# Altium schematic sheet relay_driver.SchDoc
size A4; SheetNumber: 1; SheetTotal: 4; SPICEModelCacheXGPMMDWP: <root> / <DocumentId>XGPMMDWP</DocumentId> / </root>
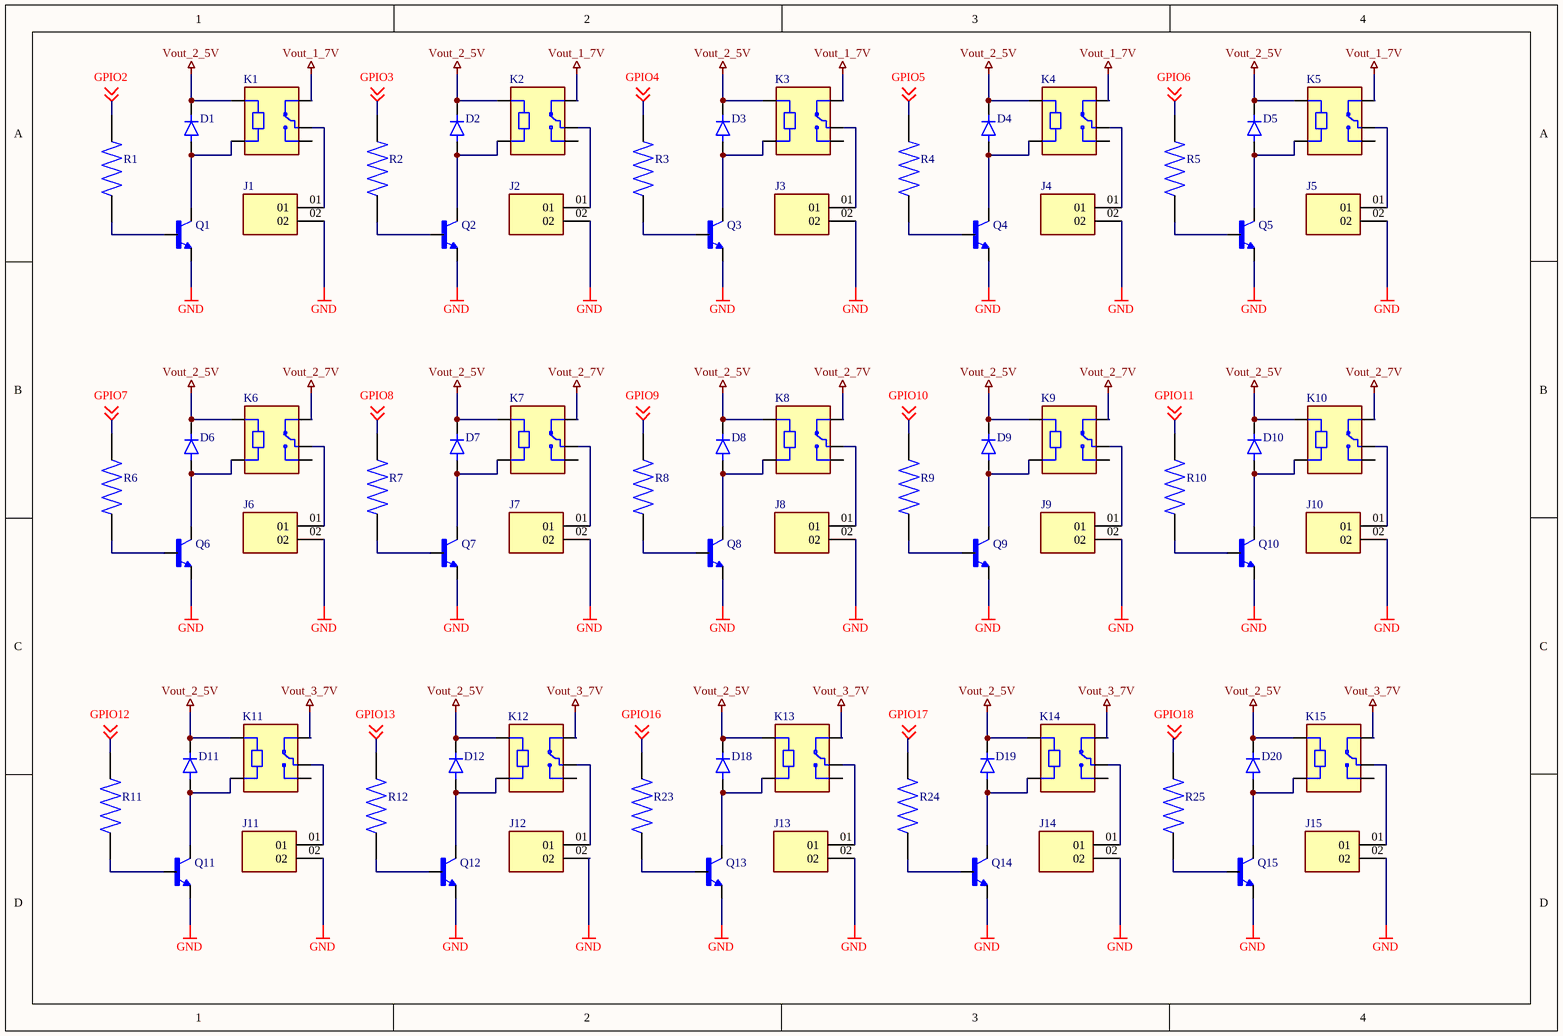
[diagram p0: relay_driver.SchDoc]

## Parts
D1  FDLL4148  [DIOMELF3414N]  (value not drawn)
D2  FDLL4148  [DIOMELF3414N]  (value not drawn)
D3  FDLL4148  [DIOMELF3414N]  (value not drawn)
D4  FDLL4148  [DIOMELF3414N]  (value not drawn)
D5  FDLL4148  [DIOMELF3414N]  (value not drawn)
D6  FDLL4148  [DIOMELF3414N]  (value not drawn)
D7  FDLL4148  [DIOMELF3414N]  (value not drawn)
D8  FDLL4148  [DIOMELF3414N]  (value not drawn)
D9  FDLL4148  [DIOMELF3414N]  (value not drawn)
D10  FDLL4148  [DIOMELF3414N]  (value not drawn)
D11  FDLL4148  [DIOMELF3414N]  (value not drawn)
D12  FDLL4148  [DIOMELF3414N]  (value not drawn)
D18  FDLL4148  [DIOMELF3414N]  (value not drawn)
D19  FDLL4148  [DIOMELF3414N]  (value not drawn)
D20  FDLL4148  [DIOMELF3414N]  (value not drawn)
J1  BBS-102-T-A  [SAMTEC_BBS-102-T-A]  (value not drawn)
J2  BBS-102-T-A  [SAMTEC_BBS-102-T-A]  (value not drawn)
J3  BBS-102-T-A  [SAMTEC_BBS-102-T-A]  (value not drawn)
J4  BBS-102-T-A  [SAMTEC_BBS-102-T-A]  (value not drawn)
J5  BBS-102-T-A  [SAMTEC_BBS-102-T-A]  (value not drawn)
J6  BBS-102-T-A  [SAMTEC_BBS-102-T-A]  (value not drawn)
J7  BBS-102-T-A  [SAMTEC_BBS-102-T-A]  (value not drawn)
J8  BBS-102-T-A  [SAMTEC_BBS-102-T-A]  (value not drawn)
J9  BBS-102-T-A  [SAMTEC_BBS-102-T-A]  (value not drawn)
J10  BBS-102-T-A  [SAMTEC_BBS-102-T-A]  (value not drawn)
J11  BBS-102-T-A  [SAMTEC_BBS-102-T-A]  (value not drawn)
J12  BBS-102-T-A  [SAMTEC_BBS-102-T-A]  (value not drawn)
J13  BBS-102-T-A  [SAMTEC_BBS-102-T-A]  (value not drawn)
J14  BBS-102-T-A  [SAMTEC_BBS-102-T-A]  (value not drawn)
J15  BBS-102-T-A  [SAMTEC_BBS-102-T-A]  (value not drawn)
K1  SRD-05VDC-SL-C  [RELAY_SRD-05VDC-SL-C]  (value not drawn)
K2  SRD-05VDC-SL-C  [RELAY_SRD-05VDC-SL-C]  (value not drawn)
K3  SRD-05VDC-SL-C  [RELAY_SRD-05VDC-SL-C]  (value not drawn)
K4  SRD-05VDC-SL-C  [RELAY_SRD-05VDC-SL-C]  (value not drawn)
K5  SRD-05VDC-SL-C  [RELAY_SRD-05VDC-SL-C]  (value not drawn)
K6  SRD-05VDC-SL-C  [RELAY_SRD-05VDC-SL-C]  (value not drawn)
K7  SRD-05VDC-SL-C  [RELAY_SRD-05VDC-SL-C]  (value not drawn)
K8  SRD-05VDC-SL-C  [RELAY_SRD-05VDC-SL-C]  (value not drawn)
K9  SRD-05VDC-SL-C  [RELAY_SRD-05VDC-SL-C]  (value not drawn)
K10  SRD-05VDC-SL-C  [RELAY_SRD-05VDC-SL-C]  (value not drawn)
K11  SRD-05VDC-SL-C  [RELAY_SRD-05VDC-SL-C]  (value not drawn)
K12  SRD-05VDC-SL-C  [RELAY_SRD-05VDC-SL-C]  (value not drawn)
K13  SRD-05VDC-SL-C  [RELAY_SRD-05VDC-SL-C]  (value not drawn)
K14  SRD-05VDC-SL-C  [RELAY_SRD-05VDC-SL-C]  (value not drawn)
K15  SRD-05VDC-SL-C  [RELAY_SRD-05VDC-SL-C]  (value not drawn)
Q1  BC817-40  [SOT95P240X120-3N]  (value not drawn)
Q2  BC817-40  [SOT95P240X120-3N]  (value not drawn)
Q3  BC817-40  [SOT95P240X120-3N]  (value not drawn)
Q4  BC817-40  [SOT95P240X120-3N]  (value not drawn)
Q5  BC817-40  [SOT95P240X120-3N]  (value not drawn)
Q6  BC817-40  [SOT95P240X120-3N]  (value not drawn)
Q7  BC817-40  [SOT95P240X120-3N]  (value not drawn)
Q8  BC817-40  [SOT95P240X120-3N]  (value not drawn)
Q9  BC817-40  [SOT95P240X120-3N]  (value not drawn)
Q10  BC817-40  [SOT95P240X120-3N]  (value not drawn)
Q11  BC817-40  [SOT95P240X120-3N]  (value not drawn)
Q12  BC817-40  [SOT95P240X120-3N]  (value not drawn)
Q13  BC817-40  [SOT95P240X120-3N]  (value not drawn)
Q14  BC817-40  [SOT95P240X120-3N]  (value not drawn)
Q15  BC817-40  [SOT95P240X120-3N]  (value not drawn)
R1  ERJB3CFR15V  [RES_ERJB3CFR15V]  (value not drawn)
R2  ERJB3CFR15V  [RES_ERJB3CFR15V]  (value not drawn)
R3  ERJB3CFR15V  [RES_ERJB3CFR15V]  (value not drawn)
R4  ERJB3CFR15V  [RES_ERJB3CFR15V]  (value not drawn)
R5  ERJB3CFR15V  [RES_ERJB3CFR15V]  (value not drawn)
R6  ERJB3CFR15V  [RES_ERJB3CFR15V]  (value not drawn)
R7  ERJB3CFR15V  [RES_ERJB3CFR15V]  (value not drawn)
R8  ERJB3CFR15V  [RES_ERJB3CFR15V]  (value not drawn)
R9  ERJB3CFR15V  [RES_ERJB3CFR15V]  (value not drawn)
R10  ERJB3CFR15V  [RES_ERJB3CFR15V]  (value not drawn)
R11  ERJB3CFR15V  [RES_ERJB3CFR15V]  (value not drawn)
R12  ERJB3CFR15V  [RES_ERJB3CFR15V]  (value not drawn)
R23  ERJB3CFR15V  [RES_ERJB3CFR15V]  (value not drawn)
R24  ERJB3CFR15V  [RES_ERJB3CFR15V]  (value not drawn)
R25  ERJB3CFR15V  [RES_ERJB3CFR15V]  (value not drawn)

## Nets
GND: J1.02 J2.02 J3.02 J4.02 J5.02 J6.02 J7.02 J8.02 J9.02 J10.02 J11.02 J12.02 J13.02 J14.02 J15.02 Q1.2(E) Q2.2(E) Q3.2(E) Q4.2(E) Q5.2(E) Q6.2(E) Q7.2(E) Q8.2(E) Q9.2(E) Q10.2(E) Q11.2(E) Q12.2(E) Q13.2(E) Q14.2(E) Q15.2(E)
Vout_1_7V: K1.NC K2.NC K3.NC K4.NC K5.NC
Vout_2_5V: D1.C D2.C D3.C D4.C D5.C D6.C D7.C D8.C D9.C D10.C D11.C D12.C D18.C D19.C D20.C K1.A2 K2.A2 K3.A2 K4.A2 K5.A2 K6.A2 K7.A2 K8.A2 K9.A2 K10.A2 K11.A2 K12.A2 K13.A2 K14.A2 K15.A2
Vout_2_7V: K6.NC K7.NC K8.NC K9.NC K10.NC
Vout_3_7V: K11.NC K12.NC K13.NC K14.NC K15.NC
GPIO2: R1.2 ; off-sheet GPIO2
GPIO3: R2.2 ; off-sheet GPIO3
GPIO4: R3.2 ; off-sheet GPIO4
GPIO5: R4.2 ; off-sheet GPIO5
GPIO6: R5.2 ; off-sheet GPIO6
GPIO7: R6.2 ; off-sheet GPIO7
GPIO8: R7.2 ; off-sheet GPIO8
GPIO9: R8.2 ; off-sheet GPIO9
GPIO10: R9.2 ; off-sheet GPIO10
GPIO11: R10.2 ; off-sheet GPIO11
GPIO12: R11.2 ; off-sheet GPIO12
GPIO13: R12.2 ; off-sheet GPIO13
GPIO16: R23.2 ; off-sheet GPIO16
GPIO17: R24.2 ; off-sheet GPIO17
GPIO18: R25.2 ; off-sheet GPIO18
NetD1_A: D1.A K1.A1 Q1.3(C)
NetD2_A: D2.A K2.A1 Q2.3(C)
NetD3_A: D3.A K3.A1 Q3.3(C)
NetD4_A: D4.A K4.A1 Q4.3(C)
NetD5_A: D5.A K5.A1 Q5.3(C)
NetD6_A: D6.A K6.A1 Q6.3(C)
NetD7_A: D7.A K7.A1 Q7.3(C)
NetD8_A: D8.A K8.A1 Q8.3(C)
NetD9_A: D9.A K9.A1 Q9.3(C)
NetD10_A: D10.A K10.A1 Q10.3(C)
NetD11_A: D11.A K11.A1 Q11.3(C)
NetD12_A: D12.A K12.A1 Q12.3(C)
NetD18_A: D18.A K13.A1 Q13.3(C)
NetD19_A: D19.A K14.A1 Q14.3(C)
NetD20_A: D20.A K15.A1 Q15.3(C)
NetJ1_01: J1.01 K1.COM
NetJ2_01: J2.01 K2.COM
NetJ3_01: J3.01 K3.COM
NetJ4_01: J4.01 K4.COM
NetJ5_01: J5.01 K5.COM
NetJ6_01: J6.01 K6.COM
NetJ7_01: J7.01 K7.COM
NetJ8_01: J8.01 K8.COM
NetJ9_01: J9.01 K9.COM
NetJ10_01: J10.01 K10.COM
NetJ11_01: J11.01 K11.COM
NetJ12_01: J12.01 K12.COM
NetJ13_01: J13.01 K13.COM
NetJ14_01: J14.01 K14.COM
NetJ15_01: J15.01 K15.COM
NetQ1_1: Q1.1(B) R1.1
NetQ2_1: Q2.1(B) R2.1
NetQ3_1: Q3.1(B) R3.1
NetQ4_1: Q4.1(B) R4.1
NetQ5_1: Q5.1(B) R5.1
NetQ6_1: Q6.1(B) R6.1
NetQ7_1: Q7.1(B) R7.1
NetQ8_1: Q8.1(B) R8.1
NetQ9_1: Q9.1(B) R9.1
NetQ10_1: Q10.1(B) R10.1
NetQ11_1: Q11.1(B) R11.1
NetQ12_1: Q12.1(B) R12.1
NetQ13_1: Q13.1(B) R23.1
NetQ14_1: Q14.1(B) R24.1
NetQ15_1: Q15.1(B) R25.1

Not connected (* = marked no-connect by the designer): K1 NO; K2 NO; K3 NO; K4 NO; K5 NO; K6 NO; K7 NO; K8 NO; K9 NO; K10 NO; K11 NO; K12 NO; K13 NO; K14 NO; K15 NO

## Library data of the parts
D1-D12 D18-D20 = FDLL4148: Diode Standard 100 V 200mA Surface Mount SOD-80; MF: ON Semiconductor; SnapEDA_Link: https://www.snapeda.com/parts/FDLL4148/Onsemi/view-part/?ref=snap; Package: SOD-80-2 ON Semiconductor; Value: *; MP: FDLL4148; Check_prices: https://www.snapeda.com/parts/FDLL4148/Onsemi/view-part/?ref=eda
J1-J15 = BBS-102-T-A: HEADER, 2.54MM, PCB, 1X2 POSITION; Product Range:BBS Series; No. of Contacts:2Contacts; Gender:Header; Pitch Spacing:2.54mm; Contact Termination Type:Through Hole; No. of Rows:1Rows; Contact Plating:Tin Plated Contacts RoHS Compliant: Yes; MF: Samtec; MP: BBS102TA; SnapEDA_Link: https://www.snapeda.com/parts/BBS102TA/Samtec/view-part/?ref=snap; Package: None; Value: *; Check_prices: https://www.snapeda.com/parts/BBS102TA/Samtec/view-part/?ref=eda
K1-K15 = SRD-05VDC-SL-C: 5V Trigger Relay Module For Arduino And Raspberry Pi 5V Trigger Relay Module For Arduino And Raspberry Pi; MF: Songle Relay; Check_prices: https://www.snapeda.com/parts/SRD-05VDC-SL-C/Songle+Relay/view-part/?ref=eda; Value: *; Availability: Not in stock; Price: None; Package: NON STANDARD-5 Songle Relay; MP: SRD-05VDC-SL-C; SnapEDA_Link: https://www.snapeda.com/parts/SRD-05VDC-SL-C/Songle+Relay/view-part/?ref=snap
Q1-Q15 = BC817-40: BJT, SOT-23, 45V, 800mA, NPN, 0.31W, 150Â°C; MF: Diotec Semiconductor; SnapEDA_Link: https://www.snapeda.com/parts/BC817-40/Diotec/view-part/?ref=snap; Package: SOT-23 Diotec; Value: *; MP: BC817-40; Check_prices: https://www.snapeda.com/parts/BC817-40/Diotec/view-part/?ref=eda
R1-R12 R23-R25 = ERJB3CFR15V: Value: 1k; MP: ERJB3CFR15V; Package: None; Price: None; Availability: Unavailable